# Altium project VFD_Clock.PrjPcb
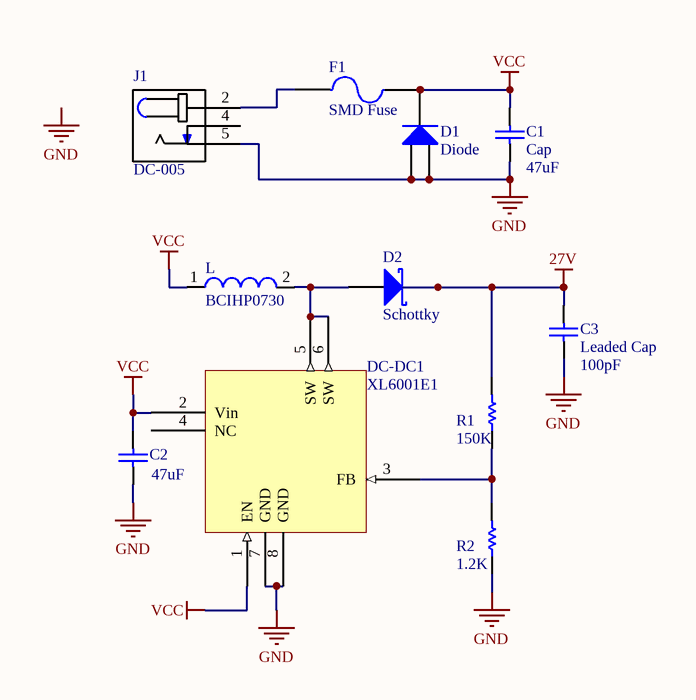
[diagram p0: VFD Clock.SchDoc]
1 sheet, 11 parts. Net scope: global (net labels, ports and power ports of the same name join across sheets).
Board file: PCB1.PcbDoc

## Sheet VFD Clock.SchDoc: VFD Clock
size A3; Author: Isaac; DrawnBy: Isaac; Revision: 1

### Parts
C1  Cap  value 47uF  [1206]
C2  value 47uF  [1206]  (hidden comment: Cap)
C3  Leaded Cap  value 100pF  [RAD-0.1]
D1  Diode  [PowerDi5]
D2  Schottky  [SMB]
DC-DC1  XL6001E1  [SOP8]
F1  SMD Fuse  [1206]
J1  DC-005  [NINIGI_DC-005]
L  BCIHP0730  [7x7]
R1  value 150K  [AXIAL-0.3]  (hidden comment: Res1)
R2  value 1.2K  [AXIAL-0.3]  (hidden comment: Res1)

### Nets
27V: C3.2 D2.2(K) R1.2
GND: C1.1 C2.1 C3.1 D1.1(A) D1.2(A) DC-DC1.7(GND) DC-DC1.8(GND) J1.5 R2.1
VCC: C1.2 C2.2 D1.3(K) DC-DC1.1(EN) DC-DC1.2(Vin) F1.2 L.1
NetD2_1: D2.1(A) DC-DC1.5(SW) DC-DC1.6(SW) L.2
NetDC-DC1_3: DC-DC1.3(FB) R1.1 R2.2
NetF1_1: F1.1 J1.2

Not connected (* = marked no-connect by the designer): DC-DC1 4(NC); J1 4

### Notes on the sheet
- Labels drawn without touching a wire or pin: GND

### Library data of the parts
D2 = D Schottky: Schottky Diode; Published: 8-Jun-2000; LatestRevisionDate: 17-Jul-2002; LatestRevisionNote: Re-released for DXP Platform.; PackageReference: SMB; Publisher: Altium Limited; PackageDescription: DO-214-AA/SMB; 2 C-Bend Leads; Body 5.3 x 3.6 mm, inc. leads (LxW); Code_JEDEC: DO-214-AA
J1 = DC-005: MF: Best Inc.; SnapEDA_Link: https://www.snapeda.com/parts/DC-005/Best%20Inc./view-part/?ref=snap; Package: None; MP: DC-005; Price: None; Availability: Unavailable; Value: *
R1 R2 = Res1: Resistor; Published: 8-Jun-2000; LatestRevisionDate: 17-Jul-2002; LatestRevisionNote: Re-released for DXP Platform.; PackageReference: AXIAL-0.3; Publisher: Altium Limited; PackageDescription: Axial Device, Thru-Hole; 2 Leads; 0.3 in Pin Spacing
C1 C2 = Cap: Published: 8-Jun-2000; LatestRevisionDate: 17-Jul-2002; LatestRevisionNote: Re-released for DXP Platform.; PackageReference: RAD-0.3; Publisher: Altium Limited; PackageDescription: Radial Cap, Thru-Hole; 2 Leads; 0.3 in Pin Spacing
C3 = Leaded Cap: Published: 8-Jun-2000; LatestRevisionDate: 17-Jul-2002; LatestRevisionNote: Re-released for DXP Platform.; PackageReference: RAD-0.3; Publisher: Altium Limited; PackageDescription: Radial Cap, Thru-Hole; 2 Leads; 0.3 in Pin Spacing
D1 = Diode: Published: 8-Jun-2000; LatestRevisionDate: 17-Jul-2002; LatestRevisionNote: Re-released for DXP Platform.; PackageVersion: Sep-1996; PackageReference: SMC; Publisher: Altium Limited; PackageDescription: DO-214-AB/SMC; 2 C-Bend Leads; Body 7.9 x 5.9 mm, inc. leads (LxW); Code_JEDEC: DO-214-AB